# Altium project IVC.PrjPcb (part 2 of 2)

## Sheet Transmission.SchDoc: Transmission Circuit
size B; Date: 2/27/2025; Author: Brach Knutson; Organization: ORGANIZATION; Address1: ADDRESS 1; Address2: ADDRESS 2; Address3: ADDRESS 3; Address4: ADDRESS 4; Revision: -; SheetNumber: 2; SheetTotal: 6; ENG_APP_DATE: --/--/--; DSN_APP_DATE: --/--/--; CHK_APP_DATE: --/--/--
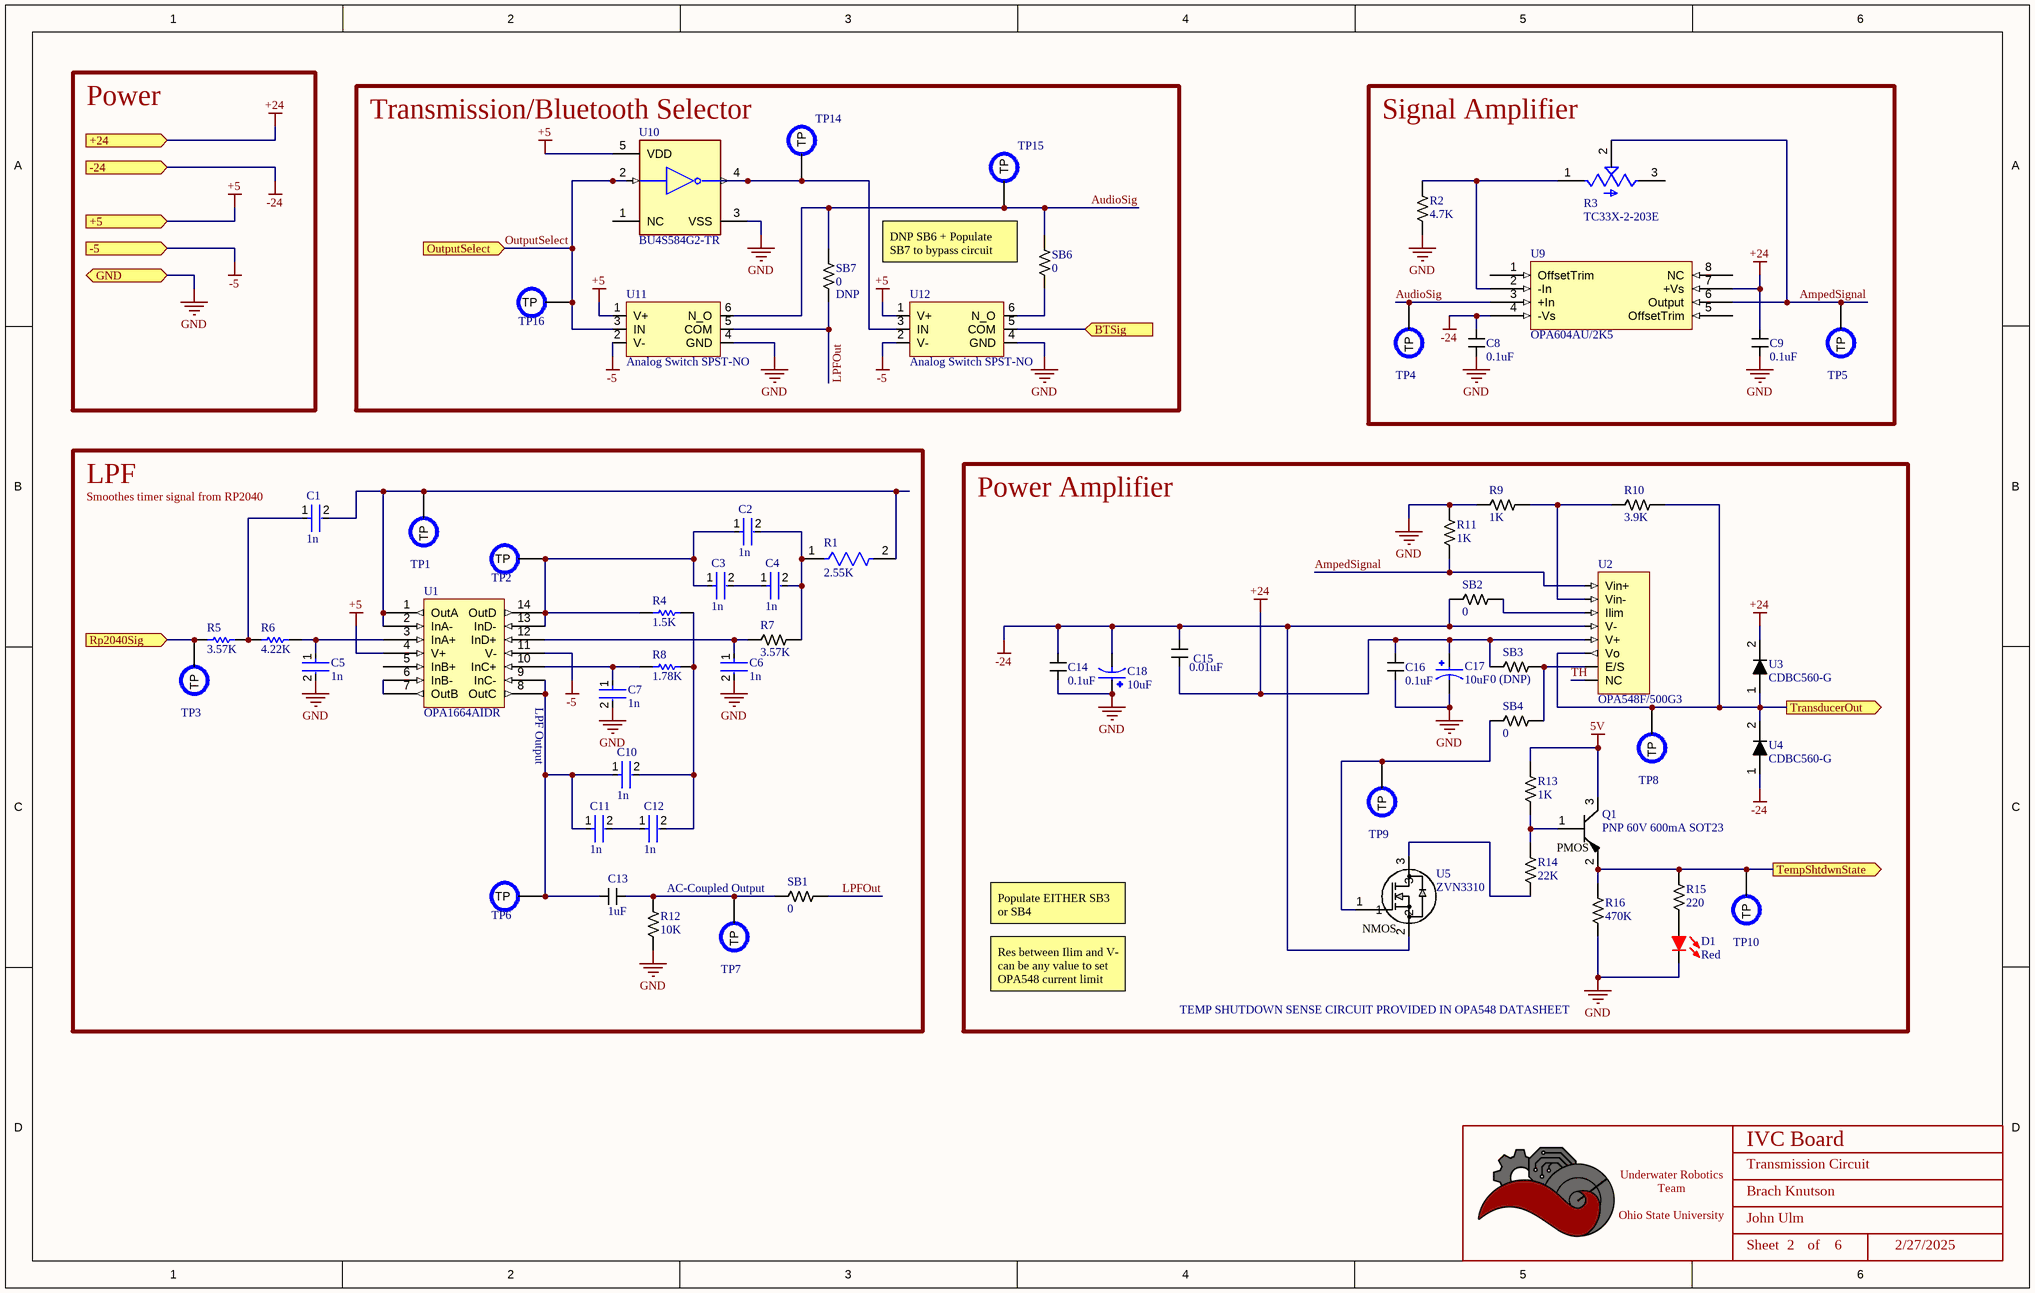
[diagram p3: Transmission.SchDoc]

### Parts
(Parts that share a designator on the sheet are numbered #1, #2 ... from top to bottom, then left to right.)
*#4  Title_Block  [LOGO]  (value not drawn)  (graphical)
C1  1n  [FP-C0603C-CF-MFG]
C2  1n  [FP-C0603C-CF-MFG]
C3  1n  [FP-C0603C-CF-MFG]
C4  1n  [FP-C0603C-CF-MFG]
C5  1n  [FP-C0603C-CF-MFG]
C6  1n  [FP-C0603C-CF-MFG]
C7  1n  [FP-C0603C-CF-MFG]
C8  value 0.1uF  [CAPACITOR_0603]  (hidden comment: 100nF Ceramic 25V)
C9  value 0.1uF  [CAPACITOR_0603]  (hidden comment: 100nF Ceramic 25V)
C10  1n  [FP-C0603C-CF-MFG]
C11  1n  [FP-C0603C-CF-MFG]
C12  1n  [FP-C0603C-CF-MFG]
C13  value 1uF  [CAPACITOR_0603]  (hidden comment: 1uF Ceramic 16V)
C14  value 0.1uF  [CAPACITOR_0603]  (hidden comment: 100nF Ceramic 25V)
C15  value 0.01uF  [CAPACITOR_0603]  (hidden comment: CL10B103KB8NNNC)
C16  value 0.1uF  [CAPACITOR_0603]  (hidden comment: 100nF Ceramic 25V)
C17  value 10uF  [CAP_EEHZC1J100P]  (hidden comment: 10uF electrolytic 63V)
C18  value 10uF  [CAP_EEHZC1J100P]  (hidden comment: 10uF electrolytic 63V)
D1  Color: Red  [LED_0603]  (hidden comment: 150060RS75000)
Q1  PNP 60V 600mA SOT23  [SOT-23-3]
R1  2.55K  [FP-CRCW0603-e3-IPC_B]
R2  Value  (Ohms): 4.7K  [RESISTOR_0603]  (hidden comment: 4.7k Ohm 5% 1/10W)
R3  TC33X-2-203E  [TRIM_TC33X-2-203E]
R4  1.5K  [RESC1608X55X25ML10T15]
R5  3.57K  [RESC1609X50X30NL10T20]
R6  4.22K  [RESC1609X50X30ML10T20]
R7  3.57K  [CAPACITOR_0603]
R8  1.78K  [RESC1608X55X30LL15T15]
R9  Value  (Ohms): 1K  [RESISTOR_0603]  (hidden comment: 1k Ohm 5% 1/8W)
R10  Value  (Ohms): 3.9K  [RESISTOR_0603]  (hidden comment: 3.9k Ohm 5% 1/10W)
R11  Value  (Ohms): 1K  [RESISTOR_0603]  (hidden comment: 1k Ohm 5% 1/8W)
R12  Value  (Ohms): 10K  [RESISTOR_0603]  (hidden comment: 10k Ohm 5% 1/10W)
R13  Value  (Ohms): 1K  [RESISTOR_0603]  (hidden comment: 1k Ohm 5% 1/8W)
R14  Value  (Ohms): 22K  [RESISTOR_0603]  (hidden comment: 3.09k Ohm 1% 1/16W)
R15  Value  (Ohms): 220  [RESISTOR_0603]  (hidden comment: 220 Ohm 5% 1/8W)
R16  Value  (Ohms): 470K  [RESISTOR_0603]  (hidden comment: 470k Ohm 5% 1/10W)
SB1  Value  (Ohms): 0  [RESISTOR_0603]  (hidden comment: 0 Ohm Jumper No Fit)
SB2#2  Value  (Ohms): 0  [RESISTOR_0603]  (hidden comment: 0 Ohm Jumper No Fit)
SB3  Value  (Ohms): 0 (DNP)  [RESISTOR_0603]  (hidden comment: 0 Ohm Jumper No Fit)
SB4  Value  (Ohms): 0  [RESISTOR_0603]  (hidden comment: 0 Ohm Jumper No Fit)
SB6  Value  (Ohms): 0  [RESISTOR_0603]  (hidden comment: 0 Ohm Jumper No Fit)
SB7  Value  (Ohms): 0  [RESISTOR_0603]  (hidden comment: 0 Ohm Jumper No Fit)
TP1  PCB Test Point  [TESTPOINT_1.2MM]  (value not drawn)  (no BOM)
TP2  PCB Test Point  [TESTPOINT_1.2MM]  (value not drawn)  (no BOM)
TP3  PCB Test Point  [TESTPOINT_1.2MM]  (value not drawn)  (no BOM)
TP4  PCB Test Point  [TESTPOINT_1.2MM]  (value not drawn)  (no BOM)
TP5  PCB Test Point  [TESTPOINT_1.2MM]  (value not drawn)  (no BOM)
TP6  PCB Test Point  [TESTPOINT_1.2MM]  (value not drawn)  (no BOM)
TP7  PCB Test Point  [TESTPOINT_1.2MM]  (value not drawn)  (no BOM)
TP8  PCB Test Point  [TESTPOINT_1.2MM]  (value not drawn)  (no BOM)
TP9  PCB Test Point  [TESTPOINT_1.2MM]  (value not drawn)  (no BOM)
TP10  PCB Test Point  [TESTPOINT_1.2MM]  (value not drawn)  (no BOM)
TP14  PCB Test Point  [TESTPOINT_1.2MM]  (value not drawn)  (no BOM)
TP15  PCB Test Point  [TESTPOINT_1.2MM]  (value not drawn)  (no BOM)
TP16  PCB Test Point  [TESTPOINT_1.2MM]  (value not drawn)  (no BOM)
U1  OPA1664AIDR  [SOIC-14]
U2  OPA548F/500G3  [7-PIN TO-263]
U3  CDBC560-G  [DO-214AB]
U4  CDBC560-G  [DO-214AB]
U5  ZVN3310  [SOT-23-3]
U9  OPA604AU/2K5  [SOIC-8]
U10  BU4S584G2-TR  [FP-SSOP5-MFG]
U11  Analog Switch SPST-NO  [TSOT-23_S6]
U12  Analog Switch SPST-NO  [TSOT-23_S6]

### Blocks framed on the sheet
Transmission/Bluetooth Selector: SB6 SB7 TP14-TP16 U10-U12
Signal Amplifier: C8 C9 R2 R3 TP4 TP5 U9
LPF: C1-C7 C10-C13 R1 R4-R8 R12 SB1 TP1-TP3 TP6 TP7 U1
Power Amplifier: C14-C18 D1 Q1 R9-R11 R13-R16 SB2#2 SB3 SB4 TP8-TP10 U2-U5

### Ports
+5 (in), +24 (in), -5 (in), -24 (in), BTSig (in), GND (bidir), OutputSelect (in), Rp2040Sig (in), TempShtdwnState (out), TransducerOut (out)

### Nets
5V: Q1.3 R13.1
+5: U1.4(V+) U10.5(VDD) U11.1(V+) U12.1(V+) ; port +5
+24: C9.1 C15.2 C16.1 C17.1 SB3.2 U2.5(V+) U3.2 U9.7(+Vs) ; port +24
-5: U1.11(V-) U11.2(V-) U12.2(V-) ; port -5
-24: C8.1 C14.1 C15.1 C18.2 SB2#2.2 U2.4(V-) U4.1 U5.2 U9.4(-Vs) ; port -24
GND: C5.2 C6.2 C7.2 C8.2 C9.2 C14.2 C16.2 C17.2 C18.1 D1.2 R2.2 R9.2 R11.1 R12.2 R16.2 U10.3(VSS) U11.4(GND) U12.4(GND) ; port GND
AmpedSignal: R3.2(W) R11.2 TP5.TP U2.1(Vin+) U9.6(Output)
AudioSig: SB6.1 SB7.1 TP4.TP TP15.TP U9.3(+In) U11.6(N_O)
BTOut: U12.5(COM) ; port BTSig
LPFOut: SB1.1 SB7.2 U11.5(COM)
OutputSelect: TP16.TP U10.2(A) U11.3(IN) ; port OutputSelect
Rp2040Sig: R5.1 TP3.TP ; port Rp2040Sig
TempShtdwnState: Q1.2 R15.1 R16.1 TP10.TP ; port TempShtdwnState
TH: U2.8(NC)
TransducerOut: R10.1 TP8.TP U2.6(Vo) U3.1 U4.2 ; port TransducerOut
NetC1_1: C1.1 R5.2 R6.1
NetC1_2: C1.2 R1.2 TP1.TP U1.1(OutA) U1.2(InA-)
NetC2_1: C2.1 C3.1 R4.1 TP2.TP U1.13(InD-) U1.14(OutD)
NetC2_2: C2.2 C4.2 R1.1 R7.1
NetC3_2: C3.2 C4.1
NetC5_1: C5.1 R6.2 U1.3(InA+)
NetC6_1: C6.1 R7.2 U1.12(InD+)
NetC7_1: C7.1 R8.1 U1.10(InC+)
NetC10_1: C10.1 C11.1 C13.2 TP6.TP U1.8(OutC) U1.9(InC-)
NetC10_2: C10.2 C12.2 R4.2 R8.2
NetC11_2: C11.2 C12.1
NetC13_1: C13.1 R12.1 SB1.2 TP7.TP
NetD1_1: D1.1 R15.2
NetQ1_1: Q1.1 R13.2 R14.1
NetR2_1: R2.1 R3.1(CCW) U9.2(-In)
NetR9_1: R9.1 R10.2 U2.2(Vin-)
NetR14_2: R14.2 U5.3
NetSB2#2_1: SB2#2.1 U2.3(Ilim)
NetSB3_1: SB3.1 SB4.1 U2.7(E/S)
NetSB4_2: SB4.2 TP9.TP U5.1
NetSB6_2: SB6.2 U12.6(N_O)
NetTP14_TP: TP14.TP U10.4(Y) U12.3(IN)
NetU1_6: U1.6(InB-) U1.7(OutB)

Not connected (* = marked no-connect by the designer): R3 3(CW); U1 5(InB+); U9 1(OffsetTrim) 5(OffsetTrim) 8(NC); U10 1(NC)

### Notes on the sheet
- Power
- (near SB7) DNP
- DNP SB6 + Populate SB7 to bypass circuit
- (near C1) Smoothes timer signal from RP2040
- (near U1) LPF Output
- AC-Coupled Output
- Populate EITHER SB3 or SB4
- Res between Ilim and V- can be any value to set OPA548 current limit
- TEMP SHUTDOWN SENSE CIRCUIT PROVIDED IN OPA548 DATASHEET
- DWG. NO.
- REV.
- SHT.
- THIS DOCUMENT AND THE DATA DISCLOSED HEREIN OR HEREWITH IS THE PROPERTY OF ALTIUM LIMITED AND MAY BE FREELY DISTRIBUTED IN WHOLE. NO RIGHTS ARE RESERVED OR EXPRESS OR IMPLIED WARANTEE GIVEN.
- REVISION
- DESCRIPTION
- DATE
- APPROVED
- ENG:
- APPROVALS
- PROJECT
- DSN:
- CHK:
- REFERENCE DOCUMENTS
- PROJECT REVISION:
- TITLE
- DOCUMENT REVISION:
- DESIGN ITEM:
- BOM:
- FAB DWG:
- PCB DWG:
- ASSY DWG:
- SCALE:
- SIZE
- B
- CAGE CODE
- FILE NAME
- DWG NO.
- SHEET
- OF
- REV
- (in symbol MMBT2907A-7-F) PMOS
- (in symbol Title_Block) Underwater Robotics Team / Ohio State University; Sheet; of
- (in symbol ZVN3310) NMOS

### Library data of the parts
*#4 = Title_Block: UWRT Schematic Title Block Template / Created June 2021, Dylan Trainor
C1-C7 C10-C12 = CMP-2006-03384-2: CAP CER 1000PF 25V 1% NP0 0603; Manufacturer: KEMET; Manufacturer Part Number: C0603C102F3GACTU; Temperature Coefficient: 30ppm/°C; Temperature Characteristic: C0G; Value: 1,000 pF; Tolerance: 0.01; Material: Ceramic; Automotive Grade: Grade 1; Temperature Range Low: -55°C; Device Class L1: Passive Components; Device Class L3: Ceramic Capacitors; Lead Free: Yes; ComponentLink2Description: Datasheet; Mouser Description: Capacitor, Ceramic, 1Nf, 25Vdc, 1-% Tol, 1+% Tol, C0g-Tc Code, -30, 30Ppm-Tc; Device Class L2: Capacitors; RoHS: TRUE; Height: 0.87mm; Digikey Description: CAP CER 1000PF 25V 1% NP0 0603; Temperature Range High: +125°C; ComponentLink2URL: https://api.kemet.com/component-edge/download/datasheet/C0603C100J5GACAUTO.pdf; Capacitance: 1,000 pF; Package: C0603C-CF; Voltage Rating: 25 V; Category: Cap; Automotive: Yes; Temperature: -55°C to +125°C; Octopart: https://octopart.com/c0603c102f3gactu-kemet-9143726
C8 C9 C14 C16 = CAPACITOR_0.1uF_0603_25V: Cap 100nF 25V +/-10% / Ceramic 0603; Voltage: 6.3V; Made By: Flip B; ComponentLink1Description: Datsheet; ComponentLink1URL: https://www.mouser.com/datasheet/2/212/KEM_C1002_X7R_SMD-1102033.pdf; Tolerance: +/- 10%; Supplier 1: Digikey; Supplier Part Number 1: 1276-1006-1-ND
C13 = CAPACITOR_1uF_0603: Cap 1uF 16V +/-10% / Ceramic 0603; Made By: Flip B; Tolerance: +/- 10%; Voltage: 16V; Supplier 1: Arrow Electronics; Supplier Part Number 1: C1608X7R1C105K080AC
C15 = CAPACITOR_0.01uF_0603_50V: 10000 pF ±10% 50V Ceramic Capacitor X7R 0603 (1608 Metric); Tolerance: +/- 10%; Voltage: 6.3V; Made By: Flip B; ComponentLink1Description: Datsheet; ComponentLink1URL: https://www.mouser.com/datasheet/2/212/KEM_C1002_X7R_SMD-1102033.pdf; Supplier 1: Arrow Electronics; Supplier Part Number 1: CL10B103KB8NNNC
C17 C18 = CAP ALUM 10UF 20% 63V SMD: 10 µF 63 V Aluminum - Polymer Capacitors Radial, Can SMD 120mOhm; Made by: Robert Pafford; Tolerance: +/- 20%; Max Voltage: 63V; Supplier 1: Digi-Key; Supplier Part Number 1: P15466CT-ND
D1 = LED_Red_0603: as D11 on sheet PowerAndConnections; Forward Voltage: 2V; Package: 0603; Supplier 1: Digi-Key; Supplier Part Number 1: 732-4978-1-ND
Q1 = MMBT2907A-7-F: PNP 60 V 600mA Surface Mount SOT-23; Vendor: Digikey; Vgs (Max): ±10V; Vgs (th): 800mV @ 250µA; Vdss: 20 V; Power Dissipation: 1.56W (Tc); Rds (on): 50mOhm @ 3A, 4.5V; Amp Rating: 600mA; BJT Type: PNP; Package: TO-236-3, SC-59, SOT-23-3; Manufacturer_Part_Number: MMBT2907A-7-F; Created By: Robert Pafford; ComponentLink1Description: Datasheet; ComponentLink1URL: https://media.digikey.com/pdf/Data%20Sheets/Diodes%20PDFs/MMBT2907A_Rev2016.pdf; Supplier 1: Digi-Key; Supplier Part Number 1: MMBT2907A-FDICT-ND
R1 = CMP-2000-03179-2: RES Thick Film, 2.55kΩ, 1%, 0.1W, 100ppm/°C, 0603; Resistance: 2.55kR; Power Rating: 100mW; Voltage Rating (DC): 75V; Composition: Thick Film; Min Operating Temperature: -55°C; Case/Package: 0603; Temperature Coefficient: 100ppm/°C; Case Code (Metric): 1608; Radiation Hardening: No; Packaging: Tape and Reel; Length: 1.55mm; Contact Plating: Tin; Case Code (Imperial): 0603; Max Operating Temperature: 155°C; Depth: 0.85mm; Weight: 7.1E-05oz; Termination: SMD/SMT; Width: 0.85mm; Military Standard: Not; Lead Free: Lead Free; Height: 0.45mm; Tolerance: 1%; Voltage Rating: 75V; Package Quantity: 5000
R2 = RESISTOR_4.7K_0603: RES 4.7k OHM 5% 1/10W 0603; Tolerance: +/- 5%; Made By: Robert Pafford; Wattage: 1/10W; Supplier: Digikey; Digikey Part Numer: CR0603-JW-104ELFTR-ND; Supplier 1: Digi-Key; Supplier Part Number 1: RMCF0603JT4K70CT-ND
R3 = TC33X-2-203E: 20 kOhms 0.1W, 1/10W J Lead Surface Mount Trimmer Potentiometer Cermet 1 Turn Top Adjustment; MF: Bourns; Value: *; SnapEDA_Link: https://www.snapeda.com/parts/TC33X-2-203E/Bourns/view-part/312812/?ref=snap; Check_prices: https://www.snapeda.com/parts/TC33X-2-203E/Bourns/view-part/312812/?ref=eda; Digi-Key_Part_Number: TC33X-2-203ECT-ND; Purchase-URL: https://pricing.snapeda.com/search/part/TC33X-2-203E/?ref=eda; Package: 1608 Bourns; MP: TC33X-2-203E; Supplier 1: Mouser; Supplier Part Number 1: 652-TC33X-2-203E
R4 = CMP-2100-03665-1: Chip Resistor, 1.5 KOhm, +/- 1%, 0.1 W, -55 to 155 degC, 0603 (1608 Metric), RoHS, Tape and Reel; Manufacturer: Yageo; Power Rating: 100mW; Voltage Rating: 50V; Temperature Coefficient: 100ppm/degreesC; Military Standard: Not; Datasheet URL: http://www.yageo.com/NewPortal/yageodocoutput?fileName=/pdf/R-Chip/PYu-RC_Group_51_RoHS_L_5.pdf; Package Description: 2-Pin Surface Mount Device, Body 1.6 x 0.8 mm; Composition: ThickFilm; Case Code (Metric): 1608; Case/Package: 0603; Number of Terminations: 2; Depth: 0.8mm; Height: 0.022inch; Manufacturer URL: http://www.yageo.com/; Lead Free: LeadFree; Min Operating Temperature: -55degC; Max Operating Temperature: 155degC; Datasheet Version: Rev. 5, 10/2016; RoHSCompliant: true; Max Power Dissipation: 100mW; Packaging: TapeandReel; Voltage Rating (DC): 50V; Length: 0.063inch; Tolerance: 1%; Width: 0.031inch; Number of Pins: 2; Termination: SMD/SMT; Package Reference: 0603; Package Quantity: 1; Case Code (Imperial): 0603; Resistance: 1.5KOhm; REACH SVHC: NoSVHC
R5 = CMP-2000-03305-1: Part Number: CRCW06033K57FKEA; Manufacturer: Vishay Dale
R6 = CMP-2000-03404-1: Part Number: CRCW06034K22FKEA; Manufacturer: Vishay Dale
R7 = RES 3.57K 1% 0603: 3.57 kOhms ±1% 0.1W, 1/10W Chip Resistor 0603 (1608 Metric) Automotive AEC-Q200 Thick Film
R8 = CMP-2000-00290-1: Part Number: ERJ-3EKF1781V; Manufacturer: Panasonic
R9 R11 R13 = RESISTOR_1K_0603: RES 1k OHM 5% 1/8W 0603; Tolerance: +/- 5%; Made By: Robert Pafford; ComponentLink1Description: Datasheet; ComponentLink1URL: https://www.bourns.com/docs/product-datasheets/CRxxxxx.pdf; Wattage: 1/8W; Supplier: Digikey; Digikey Part Numer: CR0603-JW-104ELFTR-ND; Supplier 1: Digi-Key; Supplier Part Number 1: 2019-RK73B1JTTD102JCT-ND
R10 = RESISTOR_3.9K_0603: RES 3.9k OHM 1% 1/10W 0603; Tolerance: +/- 1%; Made By: Robert Pafford; Wattage: 1/10W; Supplier 1: Digi-Key; Supplier Part Number 1: P3.90KHCT-ND
R12 = RESISTOR_10K_0603: RES 10k OHM 5% 1/10W 0603; Tolerance: +/- 5%; Wattage: 1/8W; Made By: Robert Pafford; ComponentLink1Description: Datasheet; ComponentLink1URL: https://www.bourns.com/docs/product-datasheets/CRxxxxx.pdf; Supplier: Digikey; Digikey Part Numer: CR0603-JW-104ELFTR-ND; Supplier 1: Digi-Key; Supplier Part Number 1: 2019-RK73B1JTTD103JCT-ND
R14 = RC0603FR-0722KL: RES 22K OHM 1% 1/10W 0603; Tolerance: +/- 1%; Made By: Robert Pafford; Wattage: 1/16W; Supplier 1: Digikey; Supplier Part Number 1: 13-AC0402FR-073K09LCT-ND
R15 = RESISTOR_200_0603: RES 220 OHM 5% 1/8W 0603; Tolerance: +/- 5%; Made By: John S; ComponentLink1Description: Digikey; ComponentLink1URL: https://www.digikey.com/en/products/detail/koa-speer-electronics-inc/RK73B1JTTD101J/9844701; Wattage: 1/8W; Supplier 1: Digi-Key; Supplier Part Number 1: 2019-RK73B1JTTD221JCT-ND
R16 = RESISTOR_470K_0603: RES 470k OHM 5% 1/10W 0603; Tolerance: +/- 5%; Made By: Robert P; ComponentLink1Description: Datasheet; ComponentLink1URL: https://www.bourns.com/docs/product-datasheets/CRxxxxx.pdf; Wattage: 1/10W; Supplier 1: Digi-Key; Supplier Part Number 1: RMCF0603JT470KCT-ND
SB1 SB2#2 SB3 SB4 SB6 SB7 = JUMPER_0_0603: 0 Ohm Jumper No Fit for Solder Bridge; Made By: Robert Pafford; ComponentLink1Description: Digikey; ComponentLink1URL: https://www.digikey.com/en/products/detail/koa-speer-electronics-inc/RK73B1JTTD101J/9844701
TP1-TP10 TP14-TP16 = TESTPOINT: Made By: Robert Pafford
U1 = OPA1664AIDR: IC OPAMP AUDIO 4 CIRCUIT 14SOIC
U2 = OPA548F/500G3: IC POWER 1 CIRCUIT DDPAK/TO263-7
U3 U4 = CDBC560-G: Diode Schottky 60 V 5A Surface Mount DO-214AB (SMC)
U5 = ZVN3310: MOSFET N-CH 100V 100MA SOT23-3
U10 = CMP-08923-000001-1: IC INVERTER SCHMITT 1CH 5SSOP; Manufacturer: Rohm; Standoff Height: 0mm; Number Of Outputs: 1; Logic Function Desc: Inverting; Quiescent Current: 0.2-1uA; Propagation Delay: 50ns; Max Supply Voltage: 16V; Min Supply Voltage: 3V; Max Junction Temp: +150°C; Octopart: https://octopart.com/bu4s584g2-tr-rohm-466637; Temperature Range High: +85°C; Footprint Url: https://d1d2qsbl8m0m72.cloudfront.net/en/techdata_basic/ic/package/ssop5_1-e.pdf; ComponentLink2Description: Datasheet; Temperature Range Low: -40°C; Height: 1.25mm; Device Class L1: Integrated Circuits (ICs); Ipc Land Pattern Name: SOT95P280X125-5; Mouser Description: Inverters IC SCHMITT TRIGGER SINGLE; Digikey Description: IC INVERTER SCHMITT 1CH 5SSOP; Category: IC; Device Class L3: Logic Gates; Lead Free: Yes; Automotive: No; Number Of Circuits: 1; Package: SSOP5; Manufacturer Part Number: BU4S584G2-TR; Number Of Inputs: 1; ComponentLink2URL: https://www.rohm.com/datasheet/BU4S584G2/bu4s584g2-e; Device Class L2: Logic ICs; Temperature: -40°C to +85°C; RoHS: TRUE
U11 U12 = MAX4520EUT+T: Analog Switch SPST Normally Open; MF: Analog Devices; On resistance: 160Ohm; Voltage: 9-36V; Package: SOT-23-6 Analog Devices; Circuit: SPST; Created By: Flip B; ComponentLink1Description: Datasheet; ComponentLink1URL: https://www.analog.com/media/en/technical-documentation/data-sheets/max4510-max4520.pdf; Supplier 1: Digi-Key; Supplier Part Number 1: MAX4520EUT+TCT-ND

## Nets that join several sheets
3V3_BT: PowerAndConnections (SB19.1), Bluetooth (D7.1 D10.5 TP27.TP U17.23)
5V: PowerAndConnections (8 pins), Transmission (Q1.3 R13.1)
+5: PowerAndConnections (5 pins), Receiving (8 pins), Transmission (U1.4 U10.5 U11.1 U12.1)
+24: PowerAndConnections (C43.2 D4.1 TP11.TP U6.3), Transmission (8 pins)
-5: PowerAndConnections (5 pins), Receiving (8 pins), Transmission (U1.11 U11.2 U12.2)
-24: PowerAndConnections (5 pins), Transmission (9 pins)
GND: PowerAndConnections (36 pins), Receiving (21 pins), Bluetooth (12 pins), Transmission (18 pins)
BTOut: Bluetooth (SB12.2 TP29.TP), Transmission (U12.5)
HydrophoneIn: PowerAndConnections (J1.3 SB2#1.1), Receiving (R24.2 SB8.2 TP17.TP)
TransducerOut: PowerAndConnections (J1.1), Transmission (5 pins)